# EAGLE design pwm-board (EAGLE 4.16)
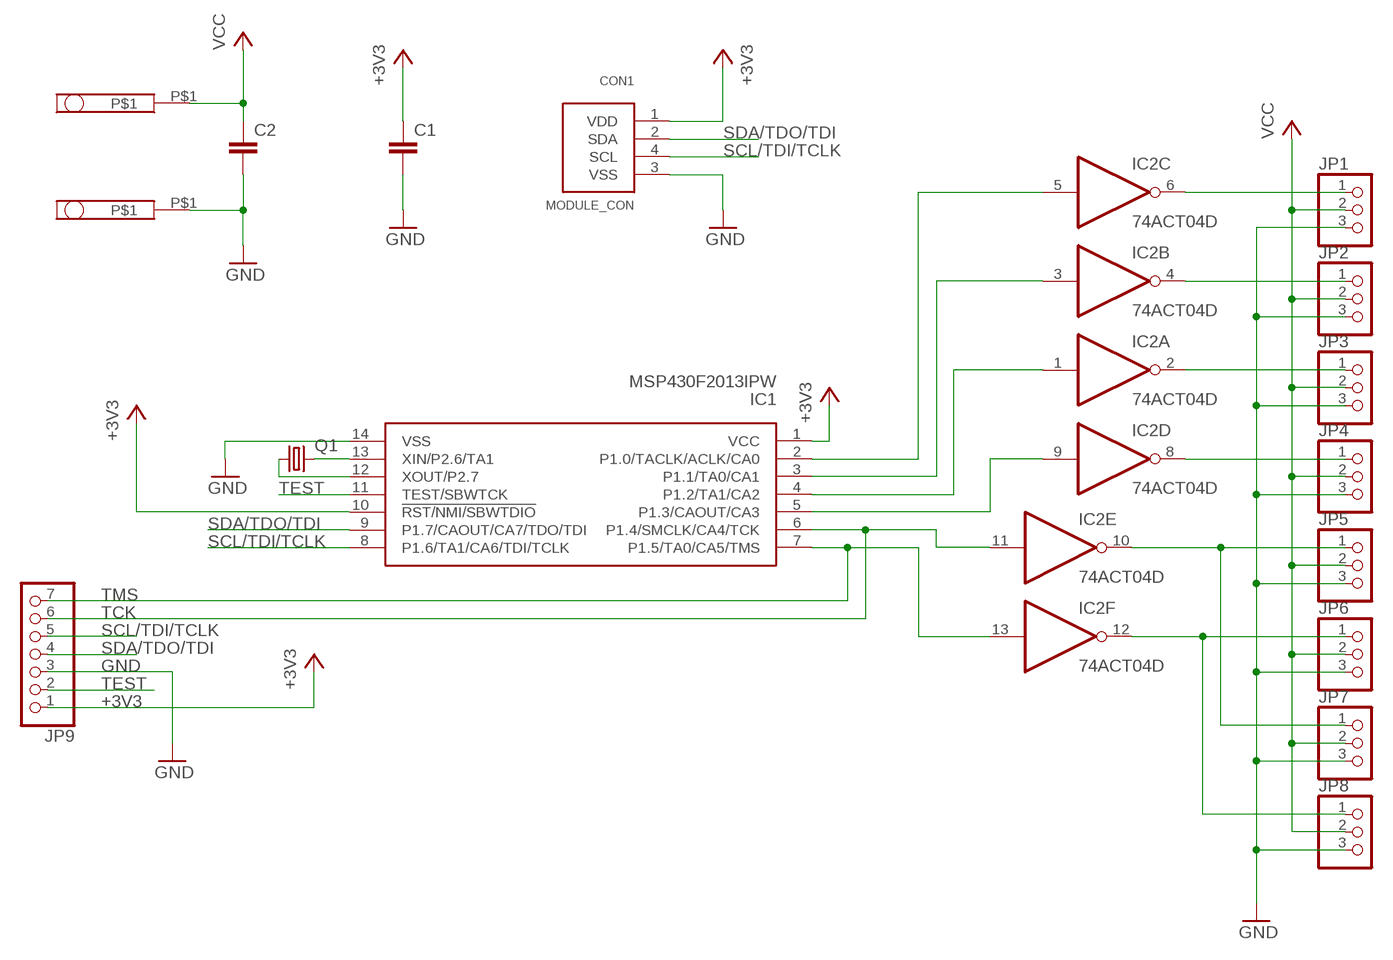
[diagram p0: schematic, sheet 1]

## Parts
C1  C-EUC0603K  [C0603K]
C2  C-EUC0603K  [C0603K]
CON1  MODULE_CON  [RJ11]
GND  4.8X0.8-SPADE  [SPADE]
IC1  MSP430F2013IPW  [TSSOP14]
IC2  74ACT04D  [SO14]
JP1  PINHD-1X3  [1X03]
JP2  PINHD-1X3  [1X03]
JP3  PINHD-1X3  [1X03]
JP4  PINHD-1X3  [1X03]
JP5  PINHD-1X3  [1X03]
JP6  PINHD-1X3  [1X03]
JP7  PINHD-1X3  [1X03]
JP8  PINHD-1X3  [1X03]
JP9  PINHD-1X7  [1X07]
Q1  CRYSTALTC26V  [TC26V]
SERVO-PWR  4.8X0.8-SPADE  [SPADE]

## Nets
+3V3: C1.1 CON1.1(VDD) IC1.1(VCC) IC1.10(!RST/NMI/SBWTDIO) JP9.1
GND: C1.2 C2.2 CON1.3(VSS) GND.P$1 IC1.14(VSS) JP1.3 JP2.3 JP3.3 JP4.3 JP5.3 JP6.3 JP7.3 JP8.3 JP9.3
N$1: IC2.10(E:O) JP5.1 JP7.1
N$2: IC2.12(F:O) JP6.1 JP8.1
N$6: IC1.2(P1.0/TACLK/ACLK/CA0) IC2.5(C:I)
N$7: IC1.12(XOUT/P2.7) Q1.1
N$8: IC1.13(XIN/P2.6/TA1) Q1.2
N$10: IC1.3(P1.1/TA0/CA1) IC2.3(B:I)
N$11: IC1.4(P1.2/TA1/CA2) IC2.1(A:I)
N$12: IC1.5(P1.3/CAOUT/CA3) IC2.9(D:I)
N$15: IC2.6(C:O) JP1.1
N$16: IC2.4(B:O) JP2.1
N$17: IC2.2(A:O) JP3.1
N$19: IC2.8(D:O) JP4.1
SCL/TDI/TCLK: CON1.4(SCL) IC1.8(P1.6/TA1/CA6/TDI/TCLK) JP9.5
SDA/TDO/TDI: CON1.2(SDA) IC1.9(P1.7/CAOUT/CA7/TDO/TDI) JP9.4
TCK: IC1.6(P1.4/SMCLK/CA4/TCK) IC2.11(E:I) JP9.6
TEST: IC1.11(TEST/SBWTCK) JP9.2
TMS: IC1.7(P1.5/TA0/CA5/TMS) IC2.13(F:I) JP9.7
VCC: C2.1 JP1.2 JP2.2 JP3.2 JP4.2 JP5.2 JP6.2 JP7.2 JP8.2 SERVO-PWR.P$1

## Power pins joined to a net without a drawn wire
GND: IC2.7(P:GND)
VCC: IC2.14(P:VCC)

## Library data of the parts
C1 C2 = rcl:C-EU: CAPACITOR, European symbol
CON1 = ecssr:MODULE_CON
GND SERVO-PWR = ecssr-Pwr:4.8X0.8-SPADE
IC1 = ecssr:MSP430F2013
IC2 = 74xx-eu:74*04: Hex INVERTER
JP1-JP8 = pinhead:PINHD-1X3: PIN HEADER
JP9 = pinhead:PINHD-1X7: PIN HEADER
Q1 = crystal:CRYSTAL: CRYSTAL

## Board
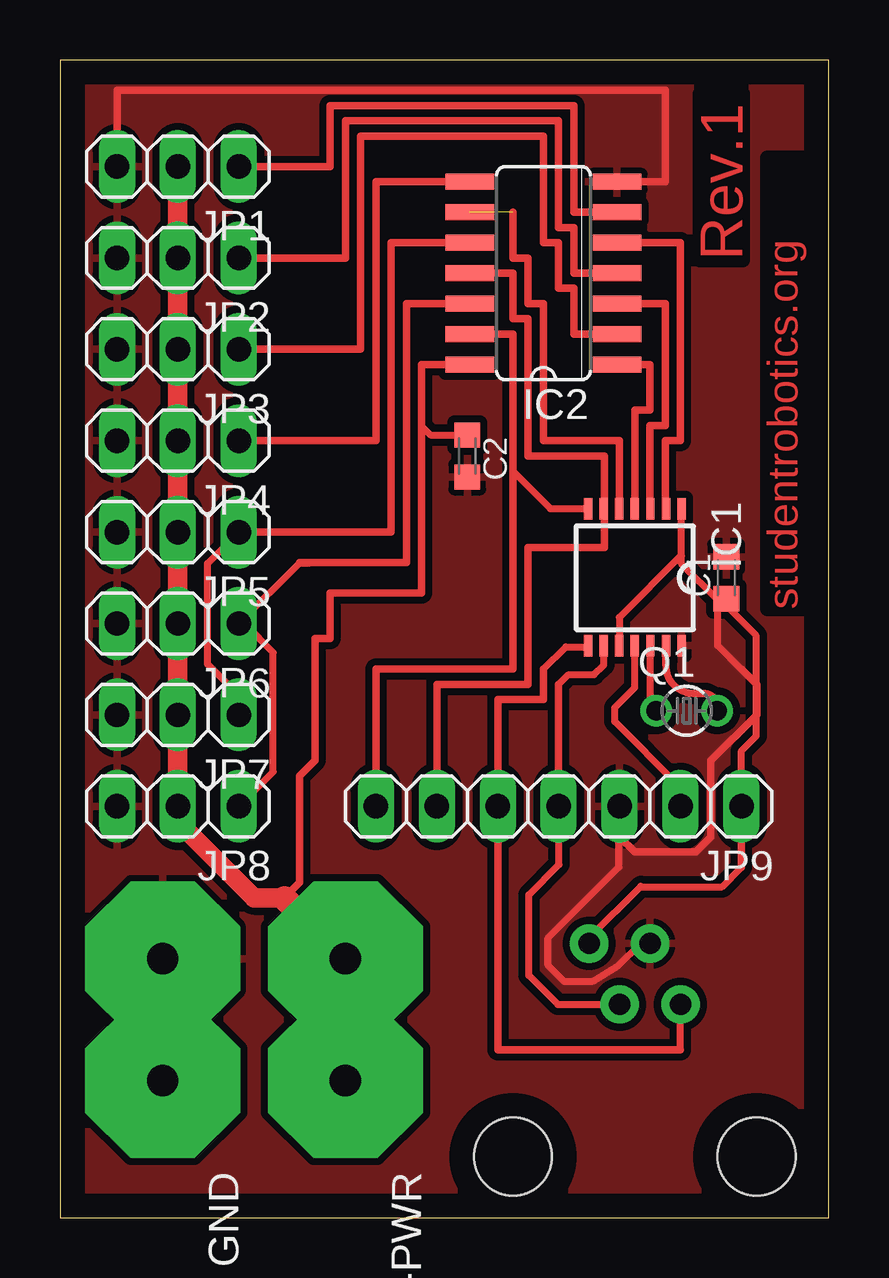
[diagram p1: board, top side]
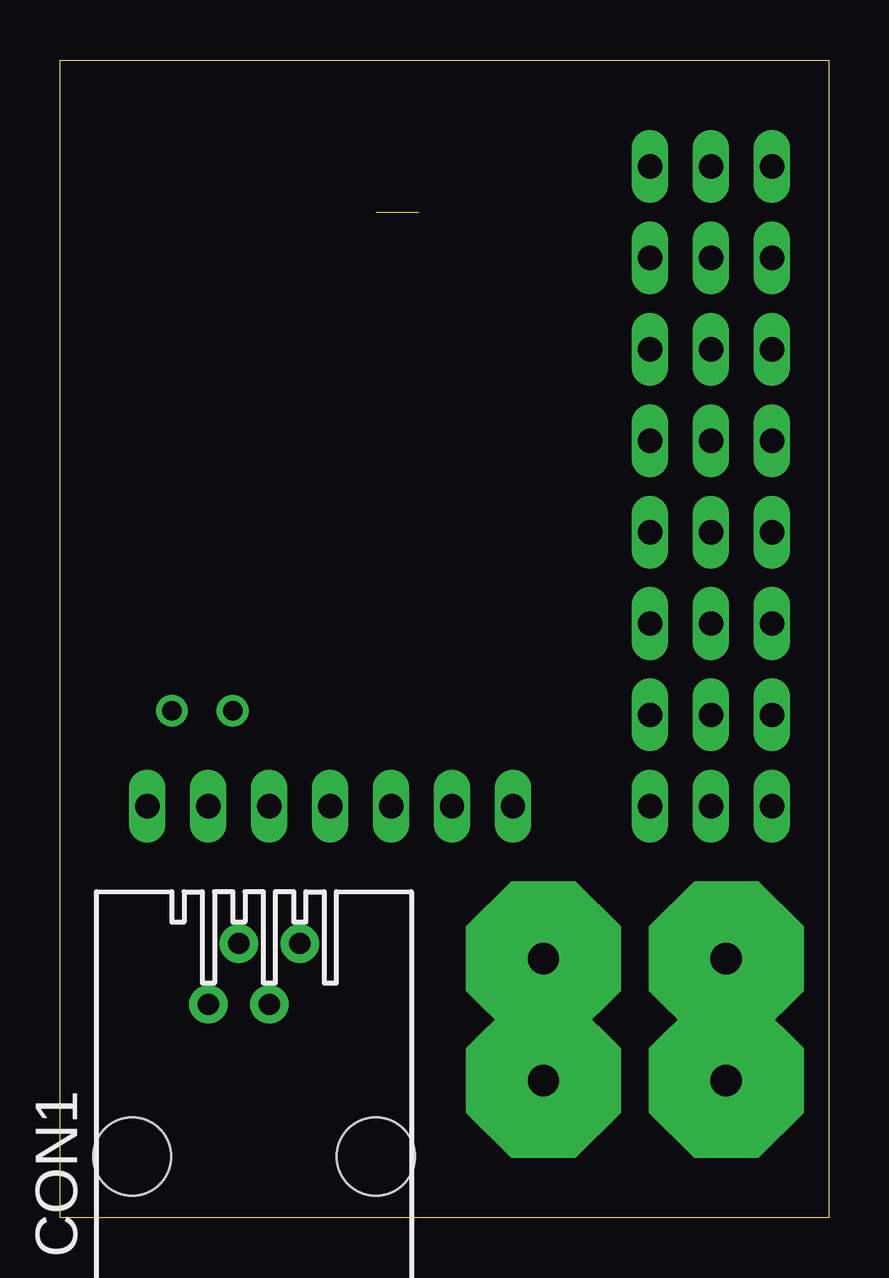
[diagram p2: board, bottom side, seen from below]

Size 32.05 x 48.25 mm. Coordinates in mm from the lower left corner, seen from the top.
Outline: 0,0 32.05,0 32.05,48.25 0,48.25 0,0
Copper layers (1*16): Top 0.035mm / dielectric 1.5mm / Bottom 0.035mm
Design rules "default": minimum track width 10mil, minimum drill 24mil, track to track 8mil, track to pad 8mil, pad to pad 8mil, via to via 8mil, smd to smd 8mil, copper to edge 40mil, drill to drill 8mil, minimum pad ring 10mil, minimum via ring 8mil, stop-mask expansion 4mil, vias tented up to drill 0mil, thermal gap 10mil

### Footprints (pad centres in the part's own frame; a part is rotated, then mirrored left to right if it is on the bottom)
C0603K = smd 1.05 x 1.08: 1 -0.875,0; 2 0.875,0
RJ11 = drill 0.889 pad 1.6 round: 1 1.905,7.62; 2 0.635,5.08; 3 -0.635,7.62; 4 -1.905,5.08 | hole 3.251: -5.08,-1.27; 5.08,-1.27
SPADE = drill 1.3 pad 6.452 octagon: P$1 -5.08,-3.175; P$2 0,-3.175
TSSOP14 = smd 0.9 x 0.35: 1 -2.875,1.95; 2 -2.875,1.3; 3 -2.875,0.65; 4 -2.875,0; 5 -2.875,-0.65; 6 -2.875,-1.3; 7 -2.875,-1.95; 8 2.825,-1.95; 9 2.825,-1.3; 10 2.825,-0.65; 11 2.825,0; 12 2.825,0.65; 13 2.825,1.3; 14 2.825,1.95
SO14 = smd 0.66 x 2.032: 1 -3.81,-3.073; 2 -2.54,-3.073; 3 -1.27,-3.073; 4 0,-3.073; 5 1.27,-3.073; 6 2.54,-3.073; 7 3.81,-3.073; 8 3.81,3.073; 9 2.54,3.073; 10 1.27,3.073; 11 0,3.073; 12 -1.27,3.073; 13 -2.54,3.073; 14 -3.81,3.073
1X03 = drill 1.016 long: 1 -2.54,0; 2 0,0; 3 2.54,0
1X07 = drill 1.016 long: 1 -7.62,0; 2 -5.08,0; 3 -2.54,0; 4 0,0; 5 2.54,0; 6 5.08,0; 7 7.62,0
TC26V = drill 0.813 round: 1 -1.27,0; 2 1.27,0

### Placement (x,y rotation side)
C1  27.77,26.66 90 top
C2  16.98,31.74 270 top
CON1  23.96,3.8 0 bottom
GND  7.46,5.71 270 top
IC1  23.96,26.66 270 top
IC2  20.15,39.37 90 top
JP1  4.92,43.81 180 top
JP2  4.92,40 180 top
JP3  4.92,36.19 180 top
JP4  4.92,32.38 180 top
JP5  4.92,28.57 180 top
JP6  4.92,24.76 180 top
JP7  4.92,20.95 180 top
JP8  4.92,17.14 180 top
JP9  20.79,17.14 180 top
Q1  26.12,21.12 0 top
SERVO-PWR  15.08,5.71 270 top

### Tracks (layer width: path | path; a pad name or v marks a point on that pad's centre or on a via)
+3V3
  Top 0.3: 28.41,14.6 28.41,14.59 27.61,13.79 24.23,13.79 24.21,13.81 22.06,11.66 CON1.1 | 25.91,27.59 25.91,27.24 27.45,25.71 27.53,25.79 C1.1 27.65,25.79 27.57,25.71 29.03,24.25 29.03,20.07 28.41,19.45 JP9.1 | 25.91,27.59 IC1.1 | 25.91,27.59 25.89,27.59 23.31,25.02 IC1.10
  Top 0.305: 28.41,14.6 JP9.1
GND
  Top 0.3: 28.47,22.79 27.42,23.84 27.42,25.42 27.77,25.77 | 23.31,17.16 23.31,17.17 | 23.31,17.16 JP9.3 | 23.31,17.16 23.31,14.61 20.35,11.65 20.35,10.51 21.01,9.85 22.21,9.85 23.27,10.49 24.19,11.41 CON1.3
  Top 0.305: IC2.7 25.23,43.18 25.23,46.98 2.38,46.98 JP1.3 | JP9.3 23.33,15.87 23.96,15.24 26.5,15.24 27.14,15.87 27.14,19.04 29.04,20.95 29.04,22.22 28.47,22.79 28.41,22.86
  pour Top (isolate 0.3): -0.8,48.89 -0.8,-1.27 33.49,-1.27 33.49,48.89 1.74,48.89
N$1
  Top 0.3: JP5.1 6.15,27.27 6.15,23.07 7.53,21.69 7.53,20.89 7.51,20.89 JP7.1
  Top 0.305: IC2.10 13.81,40.64 13.81,28.57 JP5.1
N$2
  Top 0.3: 10.43,27.3 10.43,27.29 9.99,27.29 JP6.1 7.52,24.69 7.75,24.69 8.89,23.55 8.89,18.57 JP8.1
  Top 0.305: IC2.12 14.44,38.1 14.44,27.3 10.43,27.3 10,27.3
N$6
  Top 0.305: IC2.5 25.87,40.64 25.87,32.38 25.23,32.38 25.23,29.54 IC1.2
N$7
  Top 0.3: Q1.1 24.85,21.17 arc-90 24.83,21.15 arc-90 24.61,21.36 IC1.12
N$8
  Top 0.3: Q1.2 27.39,21.27 arc-90 27.41,21.29 arc90 26.85,21.85 26.41,21.85 arc-90 25.27,22.99 IC1.13
N$10
  Top 0.305: IC2.3 25.23,38.1 25.23,33.02 24.6,33.02 IC1.3
N$11
  Top 0.305: IC2.1 24.6,35.55 24.6,33.65 23.96,33.65 IC1.4
N$12  (1 unrouted)
  Top 0.305: 18.88,41.91 18.88,40 19.52,40 19.52,38.1 20.15,38.1 20.15,32.38 23.33,32.38 IC1.5
N$15
  Top 0.305: IC2.6 21.42,41.91 21.42,46.35 11.27,46.35 11.27,43.81 JP1.1
N$16
  Top 0.305: IC2.4 21.42,39.37 21.42,41.27 20.79,41.27 20.79,45.72 11.9,45.72 11.9,40 JP2.1
N$17
  Top 0.305: IC2.2 21.42,36.83 21.42,38.73 20.79,38.73 20.79,40.64 20.15,40.64 20.15,45.08 12.54,45.08 12.54,36.19 JP3.1
N$19
  Top 0.305: 16.98,43.18 13.17,43.18 13.17,32.38 JP4.1
  Top 0.406: 16.98,43.18 IC2.8
SCL/TDI/TCLK
  Top 0.2: IC1.8
  Top 0.3: IC1.8 22.01,23.79 21.09,23.79 20.15,22.86 | 25.87,8.93 CON1.4 | 25.87,6.98 25.87,8.93 | 25.87,8.93 25.93,8.99
  Top 0.305: 20.15,22.86 20.15,21.58 18.25,21.58 JP9.5 18.25,6.98 25.87,6.98
SDA/TDO/TDI
  Top 0.2: 22.67,23.81 IC1.9 | 22.67,23.81 22.69,23.81 | 22.67,23.81
  Top 0.3: 20.81,17.17 JP9.4 | 20.81,17.17 20.81,14.71 19.55,13.45 19.55,10.09 20.75,8.89 23.4,8.89 | 20.81,17.17 20.89,17.25 | 20.79,22.22 21.2,22.63 22.27,22.63 22.67,23.03 22.67,23.81 | 23.4,8.89 CON1.2 | 23.4,8.89 23.43,8.91
  Top 0.305: JP9.4 20.79,22.22
TCK
  Top 0.305: IC2.11 18.88,39.37 18.88,37.46 19.52,37.46 19.52,31.74 22.7,31.74 22.7,29.54 | 22.7,29.54 IC1.6 | 22.7,29.54 22.7,27.93 19.52,27.93 19.52,22.22 15.71,22.22 JP9.6
TEST
  Top 0.3: 25.79,17.13 25.79,18.01 23.13,20.67 23.13,21.25 23.96,22.08 23.96,23.71 23.95,23.73 23.96,23.74 IC1.11 | 25.79,17.13 25.87,17.05 | 25.79,17.13 25.83,17.13 25.84,17.14 JP9.2
TMS
  Top 0.3: IC1.7 22,29.55 20.45,29.55 18.88,31.11
  Top 0.305: IC2.13 18.88,36.83 18.88,31.11 18.88,22.86 13.17,22.86 JP9.7
VCC
  Top 0.3: 15.08,32.95 15.11,32.95 15.44,32.62 C2.1 | 4.92,16.5 4.92,16.57 4.91,16.57 4.92,16.57 JP8.2 | 11.87,10.79 SERVO-PWR.P$1 | 9.36,13.33 9.36,13.3
  Top 0.305: IC2.14 15.08,35.55 15.08,32.95 15.08,26.03 11.27,26.03 11.27,24.12 10.63,24.12 10.63,19.04 10,18.41 10,13.97 9.36,13.33
  Top 0.813: 4.92,16.5 8.09,13.33 9.36,13.33 | JP1.2 JP2.2 JP3.2 JP4.2 JP5.2 JP6.2 JP7.2 JP8.2
  Top 1.016: 9.36,13.3 11.87,10.79

### Text on the board
Top: Rev.1 | studentrobotics.org